# EAGLE design AR0130_DEV_BOARD (EAGLE 9.4.2)
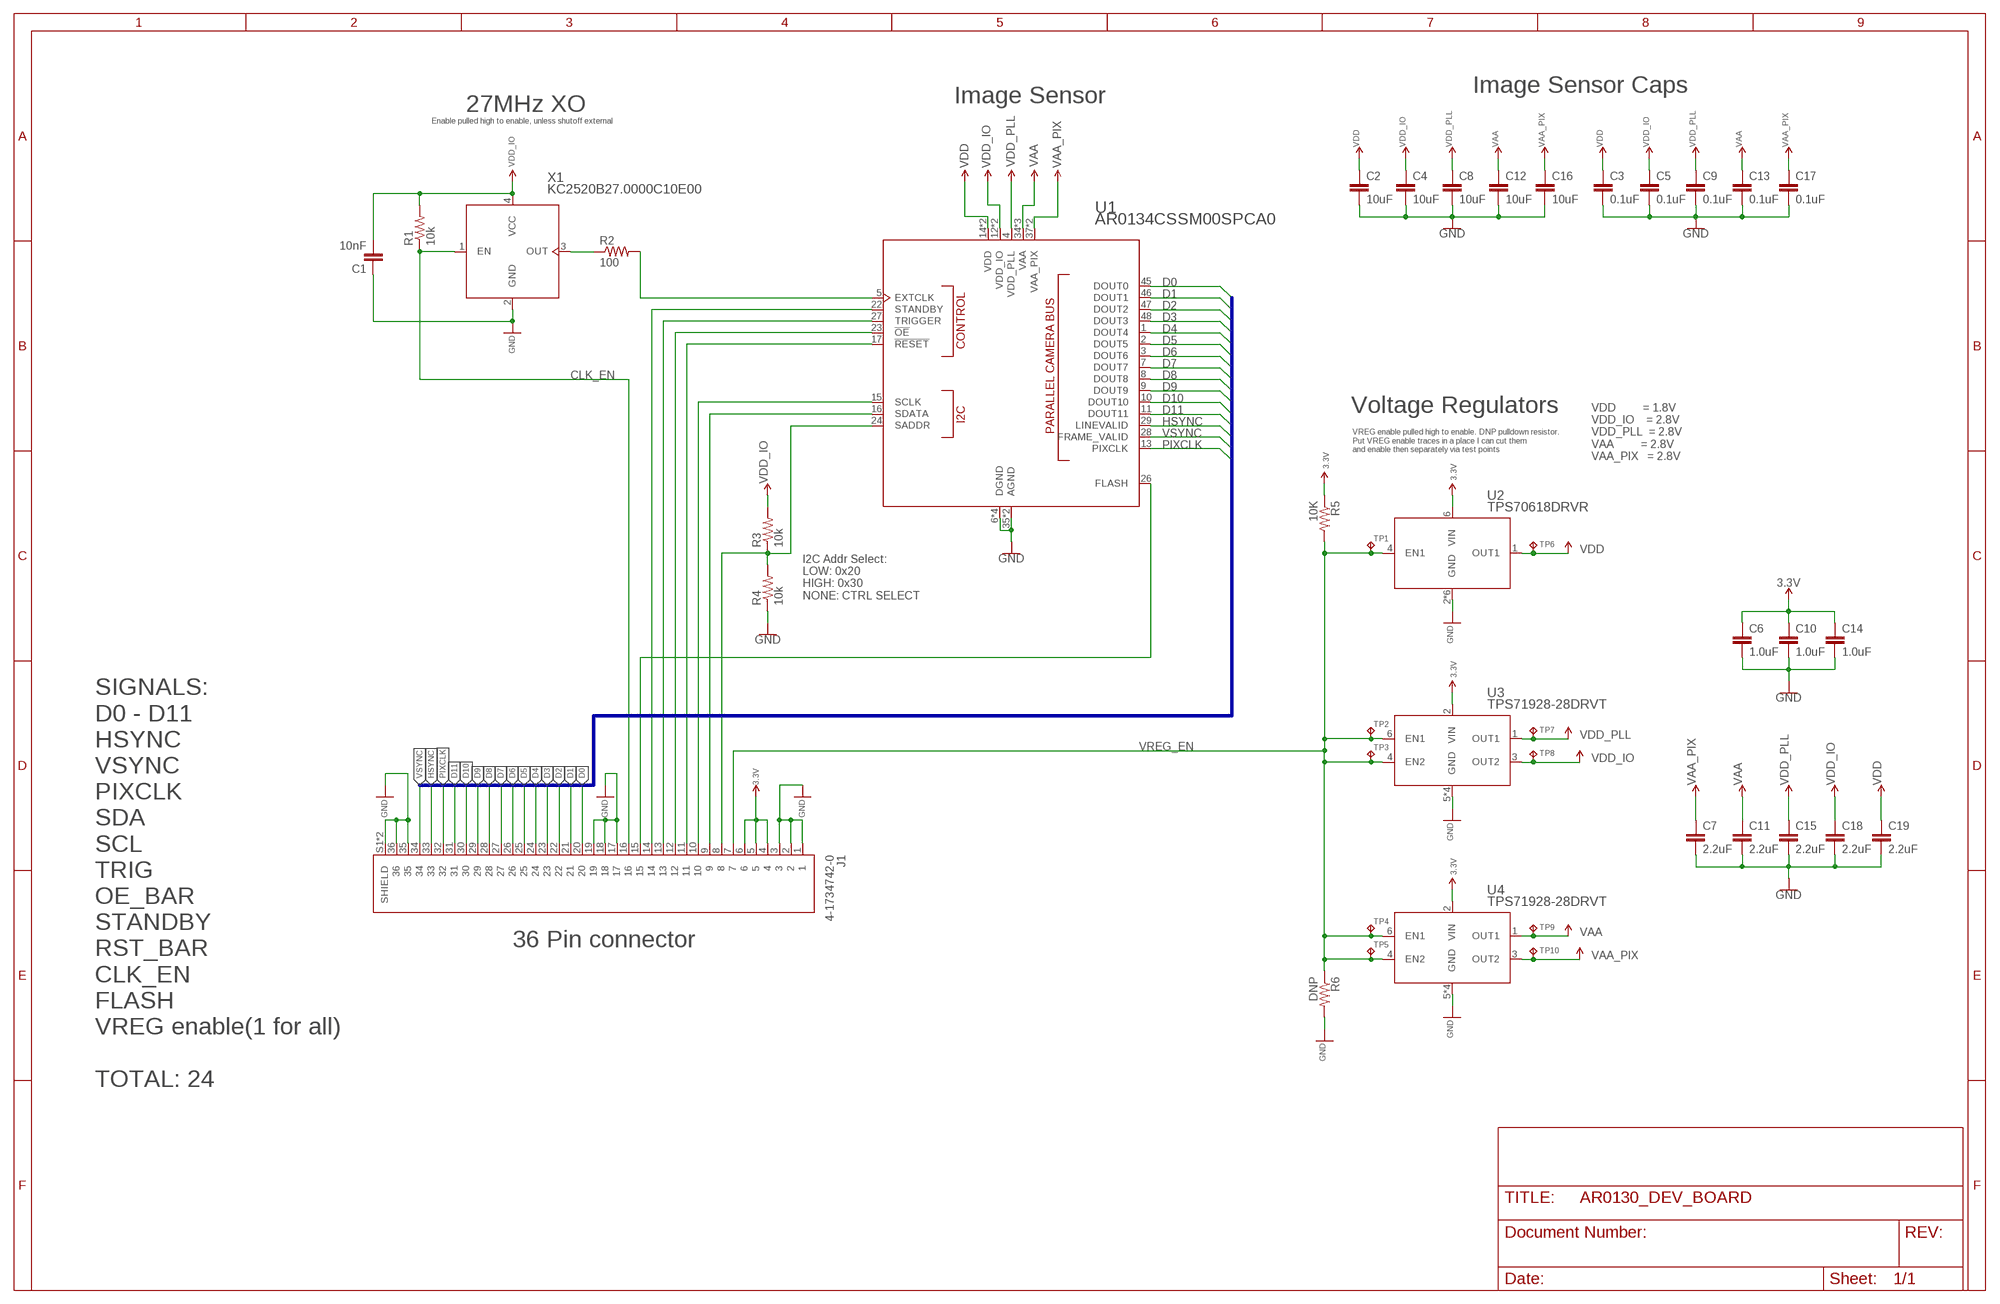
[diagram p0: schematic, sheet 1]

## Parts
C1  10nF  C-EU0402-A-NOSILK  [.0402-A-NOSILK]
C2  10uF  C-EU0603-C-NOSILK  [.0603-C-NOSILK]
C3  0.1uF  C-EU0402-B-NOSILK  [.0402-B-NOSILK]
C4  10uF  C-EU0603-C-NOSILK  [.0603-C-NOSILK]
C5  0.1uF  C-EU0402-B-NOSILK  [.0402-B-NOSILK]
C6  1.0uF  C-EU0603-C-NOSILK  [.0603-C-NOSILK]
C7  2.2uF  C-EU0603-C-NOSILK  [.0603-C-NOSILK]
C8  10uF  C-EU0603-C-NOSILK  [.0603-C-NOSILK]
C9  0.1uF  C-EU0402-B-NOSILK  [.0402-B-NOSILK]
C10  1.0uF  C-EU0603-C-NOSILK  [.0603-C-NOSILK]
C11  2.2uF  C-EU0603-C-NOSILK  [.0603-C-NOSILK]
C12  10uF  C-EU0603-C-NOSILK  [.0603-C-NOSILK]
C13  0.1uF  C-EU0402-B-NOSILK  [.0402-B-NOSILK]
C14  1.0uF  C-EU0603-C-NOSILK  [.0603-C-NOSILK]
C15  2.2uF  C-EU0603-C-NOSILK  [.0603-C-NOSILK]
C16  10uF  C-EU0603-C-NOSILK  [.0603-C-NOSILK]
C17  0.1uF  C-EU0402-B-NOSILK  [.0402-B-NOSILK]
C18  2.2uF  C-EU0603-C-NOSILK  [.0603-C-NOSILK]
C19  2.2uF  C-EU0603-C-NOSILK  [.0603-C-NOSILK]
J1  4-1734742-0  [TE_4-1734742-0]
R1  10k  R-US_0402-B  [.0402-B]
R2  100  R-US_0402-B  [.0402-B]
R3  10k  R-US_0402-B  [.0402-B]
R4  10k  R-US_0402-B  [.0402-B]
R5  10K  R-US_0402-B  [.0402-B]
R6  DNP  R-US_0402-B  [.0402-B]
TP1  TPTP06R  [TP06R]
TP2  TPTP06R  [TP06R]
TP3  TPTP06R  [TP06R]
TP4  TPTP06R  [TP06R]
TP5  TPTP06R  [TP06R]
TP6  TPTP06R  [TP06R]
TP7  TPTP06R  [TP06R]
TP8  TPTP06R  [TP06R]
TP9  TPTP06R  [TP06R]
TP10  TPTP06R  [TP06R]
U1  AR0134CSSM00SPCA0  [AR0134CSSM00SPCA0]
U2  TPS70618DRVR  [DRV6_1P6X1]
U3  TPS71928-28DRVT  [DRV6_1P6X1]
U4  TPS71928-28DRVT  [DRV6_1P6X1]
X1  KC2520B27.0000C10E00  [OSC_KYOCERA_KC2520B]

## Nets
3.3V: C6.1 C10.1 C14.1 J1.4 J1.5 J1.6 R5.1 U2.6(VIN) U3.2(VIN) U4.2(VIN)
CLK_EN: J1.16 R1.1 X1.1(EN)
D0: J1.20 U1.45(DOUT0)
D1: J1.21 U1.46(DOUT1)
D2: J1.22 U1.47(DOUT2)
D3: J1.23 U1.48(DOUT3)
D4: J1.24 U1.1(DOUT4)
D5: J1.25 U1.2(DOUT5)
D6: J1.26 U1.3(DOUT6)
D7: J1.27 U1.7(DOUT7)
D8: J1.28 U1.8(DOUT8)
D9: J1.29 U1.9(DOUT9)
D10: J1.30 U1.10(DOUT10)
D11: J1.31 U1.11(DOUT11)
GND: C1.1 C2.2 C3.2 C4.2 C5.2 C6.2 C7.2 C8.2 C9.2 C10.2 C11.2 C12.2 C13.2 C14.2 C15.2 C16.2 C17.2 C18.2 C19.2 J1.1 J1.2 J1.3 J1.17 J1.18 J1.19 J1.35 J1.36 J1.S1(SHIELD) J1.S2(SHIELD) R4.1 R6.2 U1.6(DGND) U1.25(DGND) U1.30(DGND) U1.35(AGND) U1.39(AGND) U1.44(DGND) U2.2(GND) U2.3(GND) U2.5(GND) U2.7(GND) U2.8(GND) U2.9(GND) U3.5(GND) U3.7(GND) U3.8(GND) U3.9(GND) U4.5(GND) U4.7(GND) U4.8(GND) U4.9(GND) X1.2(GND)
HSYNC: J1.33 U1.29(LINEVALID)
N$1: R2.1 X1.3(OUT)
N$2: R2.2 U1.5(EXTCLK)
N$3: J1.9 U1.16(SDATA)
N$4: J1.10 U1.15(SCLK)
N$5: J1.8 R3.1 R4.2 U1.24(SADDR)
N$6: J1.11 U1.17(!RESET)
N$7: J1.12 U1.23(!OE)
N$8: J1.13 U1.27(TRIGGER)
N$9: J1.14 U1.22(STANDBY)
N$10: J1.15 U1.26(FLASH)
PIXCLK: J1.32 U1.13(PIXCLK)
VAA: C11.1 C12.1 C13.1 TP9.TP U1.34(VAA) U1.36(VAA) U1.40(VAA) U4.1(OUT1) ; supply symbol labelled 2.8V_2, 2.8V_4, 2.8V_3
VAA_PIX: C7.1 C16.1 C17.1 TP10.TP U1.37(VAA_PIX) U1.38(VAA_PIX) U4.3(OUT2) ; supply symbol labelled 2.8V_4, 2.8V_2, 2.8V_1
VDD: C2.1 C3.1 C19.1 TP6.TP U1.14(VDD) U1.19(VDD) U2.1(OUT1) ; supply symbol labelled 1.8V
VDD_IO: C1.2 C4.1 C5.1 C18.1 R1.2 R3.2 TP8.TP U1.12(VDD_IO) U1.18(VDD_IO) U3.3(OUT2) X1.4(VCC) ; supply symbol labelled 2.8V_1, 2.8V_4
VDD_PLL: C8.1 C9.1 C15.1 TP7.TP U1.4(VDD_PLL) U3.1(OUT1) ; supply symbol labelled 2.8V_3, 2.8V_2
VREG_EN: J1.7 R5.2 R6.1 TP1.TP TP2.TP TP3.TP TP4.TP TP5.TP U2.4(EN1) U3.4(EN2) U3.6(EN1) U4.4(EN2) U4.6(EN1)
VSYNC: J1.34 U1.28(FRAME_VALID)

## Buses
D[0..11],HSYNC,PIXCLK,VSYNC

## Notes on the sheet
- Image Sensor Caps
- Image Sensor
- 27MHz XO
- Enable pulled high to enable, unless shutoff external
- Voltage Regulators
- VREG enable pulled high to enable. DNP pulldown resistor. 
  Put VREG enable traces in a place I can cut them
  and enable then separately via test points
- VDD         = 1.8V
  VDD_IO    = 2.8V
  VDD_PLL  = 2.8V
  VAA         = 2.8V
  VAA_PIX   = 2.8V
- I2C Addr Select:
  LOW: 0x20
  HIGH: 0x30 
  NONE: CTRL SELECT
- 36 Pin connector
- SIGNALS:
  D0 - D11
  HSYNC
  VSYNC
  PIXCLK
  SDA
  SCL
  TRIG
  OE_BAR
  STANDBY
  RST_BAR
  CLK_EN
  FLASH
  VREG enable(1 for all)
  
  TOTAL: 24

## Library data of the parts
C1-C19 = oresat-rcl:C-EU: CAPACITOR, European symbol
J1 = J-TEConnectivity-4-1734742-0:4-1734742-0: 36 Position FFC, FPC Connector Contacts, Vertical, 1 Sided 0.020" (0.50mm) Surface Mount; COMMENT: 4-1734742-0; DESCRIPTION: Conn FPC Connector SKT 36 POS 0.5mm Solder ST SMD T/R; DIGI-KEY_PART_NUMBER: A100242CT-ND; MF: TE Connectivity; MP: 4-1734742-0; PACKAGE: None
R1-R6 = oresat-rcl:R-US_: RESISTOR, American symbol
TP1-TP10 = J-TestPoint-Small:TP: Test pad
U1 = U-ONSemi-AR0134:AR0134CSSM00SPCA0
U2 = U-TI-TPS70618-VoltageReg:TPS70618DRVR; MANUFACTURER_PART_NUMBER: TPS7192828DRVT; VENDOR: Texas Instruments
U3 U4 = U-TI-TPS71928-28-VoltageReg:TPS71928-28DRVT; MANUFACTURER_PART_NUMBER: TPS7192828DRVT; VENDOR: Texas Instruments
X1 = X-KYOCERA-KC2520B27:KC2520B27.0000C10E00; MANUFACTURER_PART_NUMBER: KC2520B27.0000C10E00; VENDOR: Kyocera

## Board
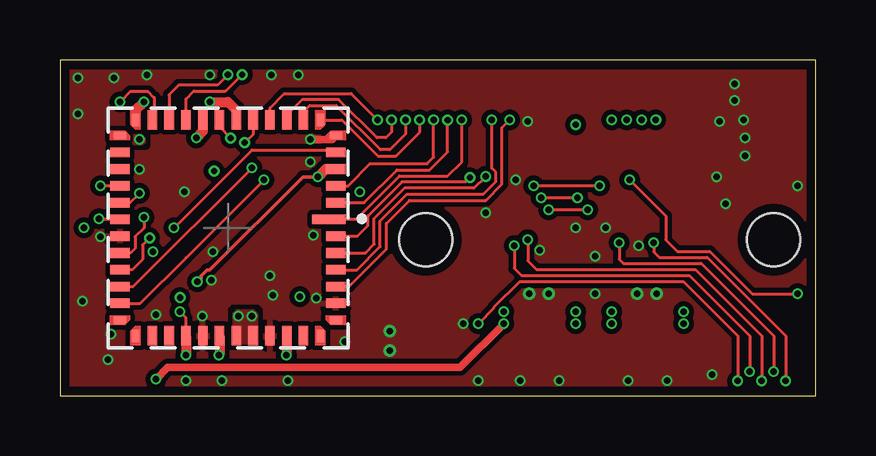
[diagram p1: board, top side]
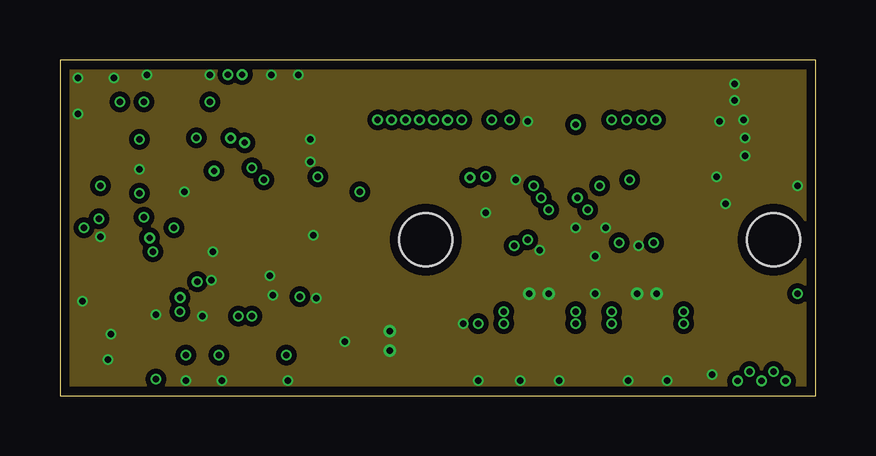
[diagram p2: board, inner layer Route2]
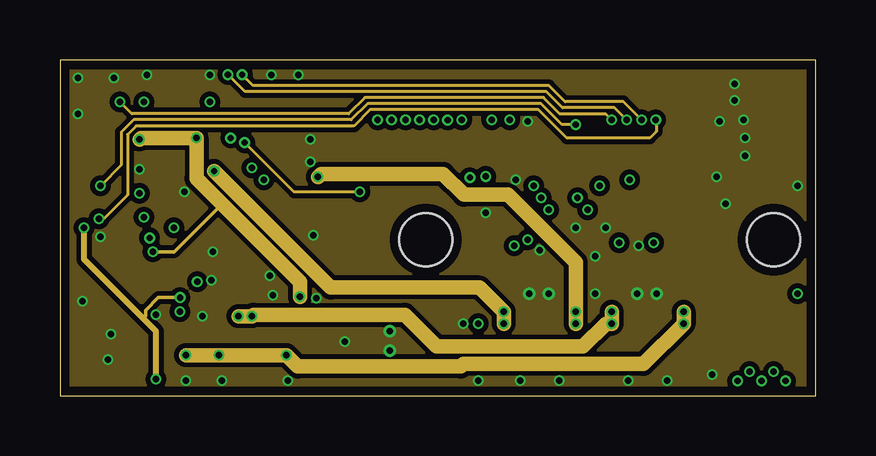
[diagram p3: board, inner layer Route15]
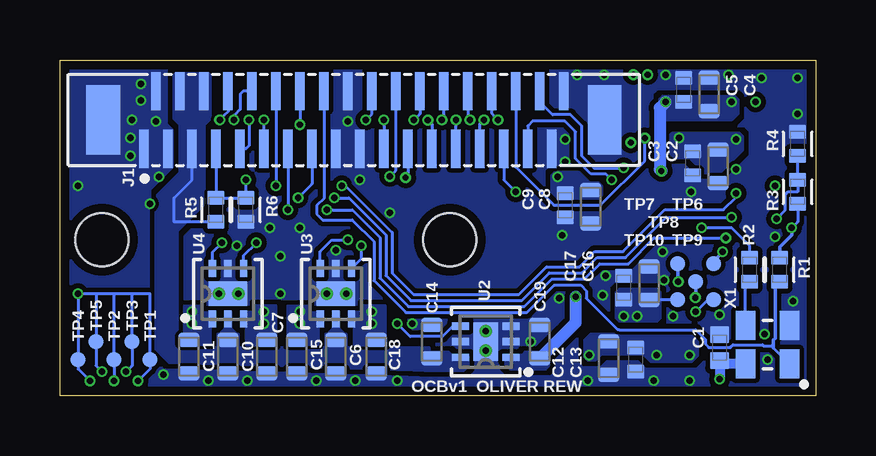
[diagram p4: board, bottom side, seen from below]

Size 31.5 x 14 mm. Coordinates in mm from the lower left corner, seen from the top.
Outline: 0,0 31.5,0 31.5,14 0,14 0,0
Copper layers (1*2*15*16): Top 0.035559375mm / dielectric 0.17018125mm / Route2 0.01778125mm / dielectric 47mil / Route15 0.01778125mm / dielectric 0.17018125mm / Bottom 0.035559375mm
Design rules "oshpark-4layer-tented": minimum track width 5mil, minimum drill 10mil, track to track 5mil, track to pad 5mil, pad to pad 5mil, via to via 5mil, smd to smd 5mil, copper to edge 15mil, drill to drill 6mil, minimum pad ring 4mil, minimum via ring 4mil, stop-mask expansion 2.5mil, vias tented up to drill 20mil, thermal gap 10mil
Holes 2.2 mm at 15.25,6.5 29.75,6.5

### Footprints (pad centres in the part's own frame; a part is rotated, then mirrored left to right if it is on the bottom)
.0402-A-NOSILK = smd 0.7 x 0.8: 1 -0.55,0; 2 0.55,0
.0603-C-NOSILK = smd 0.6 x 0.9: 1 -0.7,0; 2 0.7,0
.0402-B-NOSILK = smd 0.6 x 0.7: 1 -0.5,0; 2 0.5,0
TE_4-1734742-0 = smd 0.4 x 1.6: 1 -9.75,-1.2; 2 -9.25,1.2; 3 -8.75,-1.2; 4 -8.25,1.2; 5 -7.75,-1.2; 6 -7.25,1.2; 7 -6.75,-1.2; 8 -6.25,1.2; 9 -5.75,-1.2; 10 -5.25,1.2; 11 -4.75,-1.2; 12 -4.25,1.2; 13 -3.75,-1.2; 14 -3.25,1.2; 15 -2.75,-1.2; 16 -2.25,1.2; 17 -1.75,-1.2; 18 -1.25,1.2; 19 -0.75,-1.2; 20 -0.25,1.2; 21 0.25,-1.2; 22 0.75,1.2; 23 1.25,-1.2; 24 1.75,1.2; 25 2.25,-1.2; 26 2.75,1.2; 27 3.25,-1.2; 28 3.75,1.2; 29 4.25,-1.2; 30 4.75,1.2; 31 5.25,-1.2; 32 5.75,1.2; 33 6.25,-1.2; 34 6.75,1.2; 35 7.25,-1.2; 36 7.75,1.2 | smd 1.4 x 2.9: S1 -11.45,0; S2 9.45,0
.0402-B = smd 0.6 x 0.7: 1 -0.5,0; 2 0.5,0
TP06R = smd 0.6 x 0.6: TP 0,0
AR0134CSSM00SPCA0 = smd 0.4 x 1.4: 1 -0.35,4.2 | smd 0.4 x 0.8: 2 -1.05,4.5; 3 -1.75,4.5; 4 -2.45,4.5; 5 -3.15,4.5; 20 -3.15,-4.5; 21 -2.45,-4.5; 22 -1.75,-4.5; 23 -1.05,-4.5; 24 -0.35,-4.5; 25 0.35,-4.5; 26 1.05,-4.5; 27 1.75,-4.5; 28 2.45,-4.5; 29 3.15,-4.5; 44 3.15,4.5; 45 2.45,4.5; 46 1.75,4.5; 47 1.05,4.5; 48 0.35,4.5 | smd 0.3 x 0.5: 6 -3.85,4.5; 19 -3.85,-4.5; 30 3.85,-4.5; 43 3.85,4.5 | smd 0.5 x 0.3: 7 -4.5,3.85; 18 -4.5,-3.85; 31 4.5,-3.85; 42 4.5,3.85 | smd 0.8 x 0.4: 8 -4.5,3.15; 9 -4.5,2.45; 10 -4.5,1.75; 11 -4.5,1.05; 12 -4.5,0.35; 13 -4.5,-0.35; 14 -4.5,-1.05; 15 -4.5,-1.75; 16 -4.5,-2.45; 17 -4.5,-3.15; 32 4.5,-3.15; 33 4.5,-2.45; 34 4.5,-1.75; 35 4.5,-1.05; 36 4.5,-0.35; 37 4.5,0.35; 38 4.5,1.05; 39 4.5,1.75; 40 4.5,2.45; 41 4.5,3.15
DRV6_1P6X1 = smd 0.7 x 0.3: 1 -1.05,0.65; 2 -1.05,0; 3 -1.05,-0.65; 4 1.05,-0.65; 5 1.05,0; 6 1.05,0.65 | smd 1.016 x 1.6: 7 0,0 | drill 0.254 pad 0.508: 8 0,0.375; 9 0,-0.438
OSC_KYOCERA_KC2520B = smd 1.219 x 0.813: 1 -0.8,-0.925; 2 0.8,-0.925; 3 0.8,0.925; 4 -0.8,0.925

### Placement (x,y rotation side)
C1  4,2 270 bottom
C2  4.06,9.56 270 bottom
C3  5.12,9.69 270 bottom
C4  4.44,12.56 90 bottom
C5  5.5,12.75 90 bottom
C6  20,1.62 270 bottom
C7  22.88,1.62 270 bottom
C8  9.38,7.88 270 bottom
C9  10.44,7.94 270 bottom
C10  24.5,1.62 270 bottom
C11  26.12,1.62 270 bottom
C12  8.62,1.56 270 bottom
C13  7.5,1.5 270 bottom
C14  16,2.25 90 bottom
C15  21.62,1.62 270 bottom
C16  6.94,4.69 90 bottom
C17  8,4.5 90 bottom
C18  18.31,1.62 270 bottom
C19  11.5,2.25 90 bottom
J1  18.25,11.5 0 bottom
R1  1.5,5.25 90 bottom
R2  2.75,5.25 90 bottom
R3  0.75,8.5 270 bottom
R4  0.75,10.5 270 bottom
R5  25,7.75 90 bottom
R6  23.75,7.75 270 bottom
TP1  27.75,1.5 0 bottom
TP2  29.25,1.5 0 bottom
TP3  28.5,2.25 0 bottom
TP4  30.75,1.5 0 bottom
TP5  30,2.25 0 bottom
TP6  4.25,5.5 0 bottom
TP7  5.75,5.5 0 bottom
TP8  5,4.75 0 bottom
TP9  4.25,4 0 bottom
TP10  5.75,4 0 bottom
U1  7,7 270 top
U2  13.75,2.25 180 bottom
U3  20,4.25 90 bottom
U4  24.5,4.25 90 bottom
X1  2,2.12 90 bottom

### Tracks (layer width: path | path; a pad name or v marks a point on that pad's centre or on a via)
3.3V
  Bottom 0.127: R5.1 26.75,7.25 26.75,8.25 26,9 J1.5
  pour Bottom (rank 2, no thermals): 20.44,2.56 20.44,1.81 19.56,1.81 19.56,2.56 19.62,2.56 19.88,2.81 19.88,3.5 20.12,3.5 20.12,2.81 20.38,2.56
  pour Bottom (rank 2, no thermals): 24.94,2.56 24.94,1.81 24.06,1.81 24.06,2.56 24.12,2.56 24.38,2.81 24.38,3.5 24.62,3.5 24.62,2.81 24.88,2.56
  pour Bottom (rank 3, no thermals): 25.25,13.38 25.25,11.56 25.5,11.31 25.5,8 26.62,6.88 26.62,2.31 26.31,2 16.12,2 16.12,1.06 26.94,1.38 27.5,1.94 27.5,8.31 26.5,9.31 26.5,11.31 26.75,11.56 26.75,13.38 26.69,13.44 25.31,13.44
  pour Bottom (no thermals): 16.44,1.81 15.31,1.81 15.19,1.69 14.56,1.69 14.5,1.62 14.5,1.25 14.62,1.12 14.69,1.06 16.19,1.06 16.31,1.06 16.44,1.19
CLK_EN
  Bottom 0.127: J1.16 20.5,8.22 20.79,7.92 20.79,7.58 20.55,7.33 19.31,7.33 18.41,6.43 18.41,4.79 17.08,3.46 12.04,3.46 10.89,4.61 9.79,4.61 9.56,4.37 9.56,4.06 8.25,2.75 8.18,2.75 5,2.75 4.59,2.34 4.59,2.15 4.45,2.01 3.55,2.01 3.43,2.12 2.22,2.12 2.17,2.08 1.83,2.08 1.75,2 X1.1
  Bottom 0.15: 1.75,2 1.75,2.33 1.68,2.4 1.68,4.57 R1.1
D0  (via drill 0.25)
  Top 0.127: U1.45 12.05,4.55 13.61,6.11 13.61,7.18 14.57,8.14 17.75,8.14 18.42,8.81 18.42,11.17 v18.75,11.5
  Bottom 0.127: v18.75,11.5 18.5,11.75 J1.20
D1  (via drill 0.25)
  Top 0.127: U1.46 12.39,5.25 13.35,6.21 13.35,7.29 14.46,8.4 17.65,8.4 18.17,8.92 18.17,9.32 18,9.49 v18,11.5
  Bottom 0.127: v18,11.5 J1.21
D2  (via drill 0.25)
  Top 0.127: U1.47 12.73,5.95 13.1,6.32 13.1,7.39 14.36,8.65 17.26,8.65 v17.75,9.14
  Bottom 0.127: v17.75,9.14 17.5,9.39 J1.22
D3  (via drill 0.25)
  Top 0.127: U1.48 12.4,6.65 12.84,7.09 12.84,7.5 14.25,8.91 16.91,8.91 v17.09,9.09
  Bottom 0.127: J1.23 17,9.18 v17.09,9.09
D4  (via drill 0.25)
  Top 0.127: U1.1 12.34,7.35 14.15,9.16 16.16,9.16 16.75,9.75 v16.75,11.5
  Bottom 0.127: J1.24 16.5,11.75 v16.75,11.5
D5  (via drill 0.25)
  Top 0.127: U1.2 12.68,8.05 14.04,9.41 15.41,9.41 16.17,10.17 v16.17,11.49
  Bottom 0.127: v16.17,11.49 16,11.33 J1.25
D6  (via drill 0.25)
  Top 0.127: v15.58,11.5 15.58,9.94 15.31,9.67 12.92,9.67 12,8.75 U1.3
  Bottom 0.127: v15.58,11.5 15.5,11.58 J1.26
D7  (via drill 0.25)
  Top 0.127: U1.7 11.75,11.5 13.25,10 14,10 15,11 v15,11.5
  Bottom 0.127: J1.27 v15,11.5
D8  (via drill 0.25)
  Top 0.127: U1.8 10.15,11.84 10.41,12.1 11.51,12.1 13.36,10.25 13.75,10.25 14.41,10.91 v14.41,11.5
  Bottom 0.127: J1.28 14.5,11.59 v14.41,11.5
D9  (via drill 0.25)
  Top 0.127: v13.83,11.5 13.83,11 13.59,10.76 13.21,10.76 11.62,12.35 10.1,12.35 9.45,11.7 U1.9
  Bottom 0.127: v13.83,11.5 13.99,11.34 13.99,11.33 14,11.32 J1.29
D10  (via drill 0.25)
  Top 0.127: U1.10 8.75,12 9.35,12.6 12.14,12.6 v13.24,11.5
  Bottom 0.127: v13.24,11.5 13.41,11.66 13.41,11.67 13.5,11.76 J1.30
D11  (via drill 0.25)
  Top 0.127: U1.11 8.05,10.89 v7.7,10.55
  Route15 0.127: v12.5,8.5 9.75,8.5 v7.7,10.55
  Bottom 0.127: J1.31 13,9 v12.5,8.5
GND  (via drill 0.25)
  Top 0.305: U1.6 11.34,10.69 v10.44,10.69
  other vias: 10.44,9.75 9.94,13.38 5.94,3.31 8.88,4.19 10.69,4.06 1.69,6.62 4,3.38 2.12,2.56 10.56,6.69 8.75,5 6.31,4.81 6.38,6 5.19,8.5 3.31,9.44 9.5,0.62 6.75,0.62 0.94,3.94 3.62,13.38 6.25,13.38 0.75,11.75 20,6.06 24.12,6.25 28.12,13 28.12,12.31 28.56,10.75 28.56,10 27.5,11.44 27.38,9.12 19.5,11.44 19,9 17.75,7.62 30.75,8.75 27.75,8 27.19,0.88 11.88,2.25 16.81,3 19.19,0.62 20.81,0.62 23.69,0.62 25.31,0.62 17.44,0.62 22.31,4.25 22.31,5.81 22.75,7 0.75,13.25 2.25,13.25 2,1.5 5.25,0.62 21.5,7 28.5,11.5 8.81,13.38
  pour Top (isolate 0.2, rank 3): -0.25,-0.25 31.75,-0.25 31.75,14.25 -0.25,14.25
  pour Route2 (isolate 0.2): -1,-1 32.5,-1 32.5,15 -1,15
  pour Route15 (isolate 0.2, rank 3): -0.75,-0.75 32.25,-0.75 32.25,14.75 -0.75,14.75
  pour Bottom (isolate 0.2, rank 4, no thermals): -0.5,-0.5 32,-0.5 32,14.5 -0.5,14.5
HSYNC  (via drill 0.25)
  Top 0.127: U1.29 3.35,3.85 5.25,5.75 v8.5,9
  Bottom 0.127: v8.5,9 8.75,9.25 9.36,9.25 10,9.89 10,11 10.46,11.46 11.79,11.46 12,11.25 J1.33
N$1
  Bottom 0.127: X1.3 2.92,4.58 R2.1
N$2  (via drill 0.25)
  Top 0.127: U1.5 11.4,10.25 8,10.25 v4.75,7
  Bottom 0.127: R2.2 2.75,6.25 3.5,7 v4.75,7
N$3  (via drill 0.25)
  Top 0.127: v7,13.39 6.57,12.96 4.96,12.96 4.55,12.55 U1.16
  Route15 0.127: v23.62,11.5 23.12,12 20.95,12 20.27,12.68 7.71,12.68 v7,13.39
  Bottom 0.127: v23.62,11.5 23.62,10.43 23.75,10.3 J1.9
N$4  (via drill 0.25)
  Top 0.127: U1.15 5.25,12.38 5.58,12.7 6.9,12.7 v7.59,13.39
  Route15 0.127: v24.25,11.5 23.49,12.26 21.05,12.26 20.38,12.94 8.05,12.94 v7.59,13.39
  Bottom 0.127: J1.10 23.86,12.7 23.98,12.58 23.98,11.95 24.25,11.68 v24.25,11.5
N$5  (via drill 0.25)
  Top 0.127: v1.62,7.38 2.48,7.38 U1.24
  Route15 0.127: v24.83,11.5 24.86,11.48 24.86,11.01 24.59,10.75 21.12,10.75 19.96,11.92 12.92,11.92 12.25,11.25 3.17,11.25 2.81,10.89 2.81,8.38 1.81,7.38 v1.62,7.38
  Bottom 0.127: J1.8 24.5,11.84 24.67,11.67 24.67,11.66 v24.83,11.5 | R4.2 R3.1 0.75,8.5 0.76,8.49 1.15,8.49 1.29,8.35 1.29,7.71 v1.62,7.38
N$6  (via drill 0.25)
  Top 0.127: U1.17 3.94,11.59 3.94,12.44 3.9,12.44 3.67,12.67 2.92,12.67 v2.5,12.25
  Route15 0.127: v23,11.5 22.75,11.75 20.84,11.75 20.17,12.43 12.71,12.43 12.04,11.76 2.99,11.76 v2.5,12.25
  Bottom 0.127: J1.11 v23,11.5
N$7  (via drill 0.25)
  Top 0.127: v22.5,8.75 v19.75,8.75 | v3.31,8.44 2.92,8.05 U1.23
  Bottom 0.127: J1.12 v22.5,8.75 | v19.75,8.75 19.59,8.75 17.65,6.81 17.65,5.11 16.77,4.22 12.36,4.22 11.21,5.37 9.85,5.37 9.21,6.01 8.02,6.01 6.28,7.75 3.84,7.75 3.31,8.28 v3.31,8.44
N$8  (via drill 0.25)
  Top 0.127: v22,7.75 v20.38,7.75 | v3.73,6.58 3.44,6.28 3.44,5.69 3,5.25 U1.27
  Bottom 0.127: J1.13 v22,7.75 | v20.38,7.75 19.31,7.75 18.16,6.6 18.16,4.9 16.98,3.71 12.14,3.71 11,4.86 9.64,4.86 9,5.5 7.81,5.5 6.73,6.58 v3.73,6.58
N$9  (via drill 0.25)
  Top 0.127: U1.22 v1.69,8.75
  Route15 0.127: v21.5,11.3 20.93,11.3 20.06,12.17 12.81,12.17 12.14,11.5 3.07,11.5 2.56,10.99 2.56,9.62 v1.69,8.75
  Bottom 0.127: J1.14 v21.5,11.3
N$10  (via drill 0.25)
  Top 0.127: v21.58,8.25 v20.06,8.25 | v3.5,7.44 3.5,7 3.13,6.63 3.13,6.13 2.95,5.95 U1.26
  Bottom 0.127: v21.58,8.25 21,8.83 J1.15 | v20.06,8.25 19.45,8.25 17.91,6.7 17.91,5 16.87,3.97 12.25,3.97 11.1,5.12 9.74,5.12 9.11,5.75 7.92,5.75 6.23,7.44 v3.5,7.44
PIXCLK  (via drill 0.25)
  Top 0.127: v7.12,10.74 6.65,11.21 U1.13
  Bottom 0.127: J1.32 12.5,9.53 10.92,7.95 8.96,7.95 7.12,9.79 v7.12,10.74
VAA  (via drill 0.25)
  Top 0.127: U1.34 5.25,3.25 v5,3.5
  Top 0.406: U1.36 6.65,1.71 v6.62,1.69 | U1.34 v5.25,1.69 | U1.40 v9.45,1.7 v9.44,1.69
  Route15 0.61: v26,3.5 v26,3 24.32,1.32 16.82,1.32 16.71,1.22 9.91,1.22 v9.44,1.69 v6.62,1.69 v5.25,1.69
  Bottom 0.127: TP9.TP 4.5,4 v5,3.5
  pour Bottom (no thermals): 25.06,2.91 25.25,2.91 25.25,2.12 26.31,2.12 26.31,3.75 25.66,3.75 25.66,3.47 25.06,3.47
  pour Bottom (no thermals): 7.19,1.75 6.88,1.44 6.56,1.44 5.19,1.44 5,1.62 4.94,1.69 4.94,2.25 5.25,2.56 8.44,2.56 9.38,2.56 9.62,2.31 9.62,1.69 9.62,1.62 9.5,1.5 9.19,1.5 8.94,1.75
VAA_PIX  (via drill 0.25)
  Route15 0.61: v7.44,3.31 v8,3.31 8.06,3.38 14.38,3.38 15.7,2.05 21.8,2.05 22.75,3 v23,3 v23,3.5
  Bottom 0.127: TP10.TP 6.92,4 C16.1
  pour Bottom (no thermals): 23.94,2.91 23.75,2.91 23.75,2.12 22.5,2.12 22.5,3.75 23.34,3.75 23.34,3.47 23.94,3.47
  pour Bottom (no thermals): 8.31,4.31 8.31,3.25 8.19,3.12 6.62,3.12 6.5,3.25 6.5,4.31 6.62,4.44 8.19,4.44
  pour Top (no thermals): 7.38,3.56 8.06,3.56 8.19,3.44 8.19,2.25 8.12,2.19 7.31,2.19 7.25,2.25 7.25,3.44
VDD  (via drill 0.25)
  Top 0.406: U1.14 5.95,11.01 v5.69,10.75
  Route15 0.15: 6.75,8 4.75,6 v3.88,6
  Route15 0.61: v10,4.12 10,4.75 6.75,8 5.69,9.06 v5.69,10.75 3.38,10.75 v3.31,10.69
  Bottom 0.15: v3.88,6 4.25,5.62 TP6.TP
  Bottom 0.508: C19.1 10,3.05 v10,4.12
  pour Bottom (no thermals): 5.25,9.94 5.88,9.94 6.12,10.19 6.12,10.81 6,10.94 3.19,10.94 3.06,10.81 3.06,10.25 4.31,9
  pour Top (no thermals): 2.5,11 2.81,11 2.94,10.88 3.38,10.88 3.5,10.75 3.5,10.56 3.44,10.5 3.06,10.5 3,10.56 2.88,10.69 2.5,10.69 2.31,10.69 2.25,10.75 2.25,10.94 2.31,11
  pour Bottom (no thermals): 11.5,1.81 12.12,1.81 12.25,1.69 12.88,1.69 12.94,1.62 12.94,1.44 12.94,1.31 12.81,1.19 12.75,1.12 11.31,1.12 11.25,1.12 11.12,1.25 11.12,1.62 11.12,1.69 11.25,1.81
VDD_IO  (via drill 0.25)
  Top 0.305: v18.5,3 16.68,1.18 4.49,1.18 v4,0.69
  Top 0.406: U1.18 3.15,11.9 v3.5,12.25 | v6.25,12.25 7,12.25 7.35,11.9 U1.12
  Route15 0.15: 3.47,3.22 3.57,3.32 3.57,3.55 4.1,4.08 v5.01,4.08
  Route15 0.254: v4,0.69 4,2.69 3.47,3.22 1,5.69 v1,7
  Route15 0.61: v18.5,3 v18.5,3.5 17.5,4.5 11.29,4.5 v6.42,9.37
  Bottom 0.127: R3.2 0.75,7.25 v1,7
  Bottom 0.15: R1.2 1.5,6.2 1,6.7 v1,7 | v5.01,4.08 5,4.09 TP8.TP
  Bottom 0.406: X1.4 3.88,1.32 C1.2 v4,0.69
  Bottom 0.508: v6.25,12.25 6.5,12 6.5,9.44 v6.42,9.37
  pour Bottom (no thermals): 19.44,2.91 19.25,2.91 19.25,2.12 17.94,2.12 17.94,3.75 18.84,3.75 18.84,3.47 19.44,3.47
  pour Bottom (no thermals): 5.81,12.5 3.38,12.5 3.25,12.38 3.25,11.75 3.5,11.5 6.25,11.5 6.5,11.75 6.5,12.38 6.38,12.5
VDD_PLL  (via drill 0.25)
  Top 0.15: v10.75,9.12 10.12,9.12 6.24,5.24 6.13,5.24 5.88,4.99 5.88,4.88 5.75,4.75 v5.73,4.75
  Top 0.406: v10.75,9.12 11.07,9.45 U1.4
  Route15 0.61: v21.5,3 v21.5,3.5 21.5,5.56 18.68,8.38 16.84,8.38 15.97,9.25 10.88,9.25 v10.75,9.12
  Bottom 0.15: TP7.TP 5.75,4.77 v5.73,4.75
  pour Bottom (no thermals): 20.56,2.91 20.75,2.91 20.75,2.12 22,2.12 22,3.75 21.16,3.75 21.16,3.47 20.56,3.47
  pour Bottom (no thermals): 10.75,8.25 11,8.5 11,9 11,9.19 10.88,9.31 9.88,9.31 9.81,9.25 9.44,8.88 9.12,8.88 9.06,8.88 8.94,8.75 8.94,8.38 9.06,8.25 9.94,8.25
VREG_EN  (via drill 0.25)
  Top 0.127: v23.75,9 25.25,7.5 25.25,6.5 25.73,6.02 27.09,6.02 28.86,4.25 v30.75,4.25 | v28.25,0.61 28.25,2.5 26,4.75 19.16,4.75 18.08,3.67 18.08,3.64 v17.44,3 | v19.5,6.5 19.5,5.62 19.87,5.26 26.49,5.26 29.25,2.5 v29.25,0.61 | v18.94,6.25 18.94,5.31 19.25,5 26.25,5 28.75,2.5 v28.75,1 | v24.75,6.38 24.75,6 24.98,5.77 26.98,5.77 30.25,2.5 v30.25,0.61 | v23.31,6.38 23.31,5.69 23.49,5.51 26.74,5.51 29.75,2.5 v29.75,1
  Bottom 0.127: J1.7 R5.2 R6.1 v23.75,9 | U2.4 15.12,2.9 15.56,2.46 16.9,2.46 v17.44,3 | v28.25,0.61 27.75,1.11 TP1.TP 27.75,4.25 28.5,4.25 | v19.5,6.5 19.52,6.48 20.17,6.48 20.65,6 U3.6 | v29.25,0.61 TP2.TP 29.25,4.25 | U3.4 18.94,5.71 v18.94,6.25 | v28.75,1 28.5,1.25 TP3.TP 28.5,4.25 | v24.75,6.38 25.15,5.97 U4.6 | v30.25,0.61 30.75,1.11 TP4.TP v30.75,4.25 30,4.25 | U4.4 23.85,5.84 v23.31,6.38 | v29.75,1 30,1.25 TP5.TP 30,4.25 | 28.5,4.25 29.25,4.25 | 29.25,4.25 30,4.25
VSYNC  (via drill 0.25)
  Top 0.127: U1.28 3.05,4.55 v8,9.5
  Bottom 0.127: v8,9.5 9.25,9.5 9.75,10 9.75,11.25 10.21,11.71 10.96,11.71 11.5,12.25 J1.34

### Text on the board
bPlace: OCBv1 OLIVER REW
Document: Holes are 2.4mm for M2 through hole | OCBv1 == Oresat Camera Board v1 | M2 screws / 2.2mm through hole / 4mm head clearance / MC: 91292A004